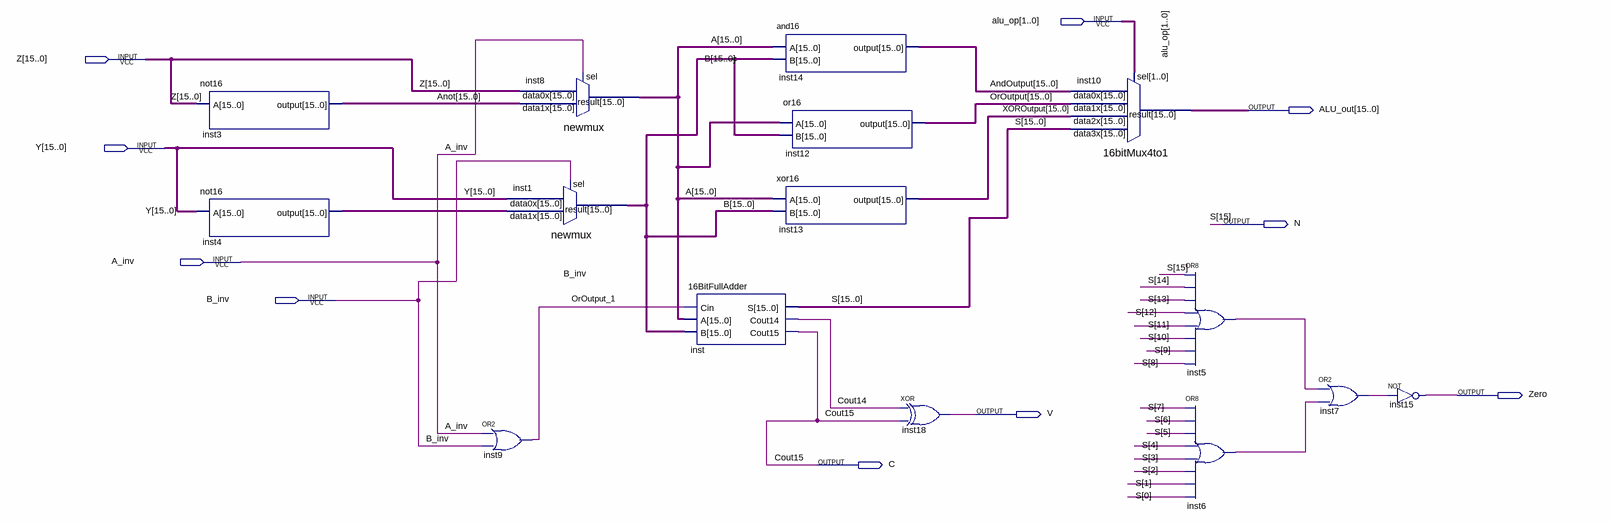
[diagram p0: schematic sheet]
// Quartus schematic alu.bdf as structural Verilog: 15 symbols, 10 pins
module alu (
  input  [1:0] alu_op,
  input  [15:0] Z,
  input  [15:0] Y,
  input  A_inv,
  input  B_inv,
  output [15:0] ALU_out,
  output N,
  output Zero,
  output V,
  output C
);

  wire Cout14, inst5_out, inst6_out, inst7_out, OrOutput_1;
  wire [14:0] S;
  wire [15:0] A, AndOutput, Anot, B, inst4_output, OrOutput, XOROutput;

  not16 inst3 (.A(Z), .\output (Anot));
  not16 inst4 (.A(Y), .\output (inst4_output));
  or inst9 (OrOutput_1, A_inv, B_inv);
  newmux inst8 (.data1x(Anot), .data0x(Z), .sel(A_inv), .result(A));
  newmux inst1 (.data1x(inst4_output), .data0x(Y), .sel(B_inv), .result(B));
  \16BitFullAdder  inst (.Cin(OrOutput_1), .A(A), .B(B), .S({N, S}), .Cout14(Cout14), .Cout15(C));
  and16 inst14 (.A(A), .B(B), .\output (AndOutput));
  or16 inst12 (.A(A), .B(B), .\output (OrOutput));
  xor16 inst13 (.A(A), .B(B), .\output (XOROutput));
  xor inst18 (V, Cout14, C);
  \16bitMux4to1  inst10 (
    .data3x({N, S}), .data2x(XOROutput), .data1x(OrOutput), .data0x(AndOutput), .sel(alu_op), .result(ALU_out));
  or inst5 (inst5_out, N, S[14], S[13], S[12], S[11], S[10], S[9], S[8]);
  or inst6 (inst6_out, S[7], S[6], S[5], S[4], S[3], S[2], S[1], S[0]);
  or inst7 (inst7_out, inst5_out, inst6_out);
  not inst15 (Zero, inst7_out);

  // Other names for the same wires on the sheet: Cout15 = C; S[15] = N
endmodule
